# EAGLE design FordACPAUX (EAGLE 8.2.2)
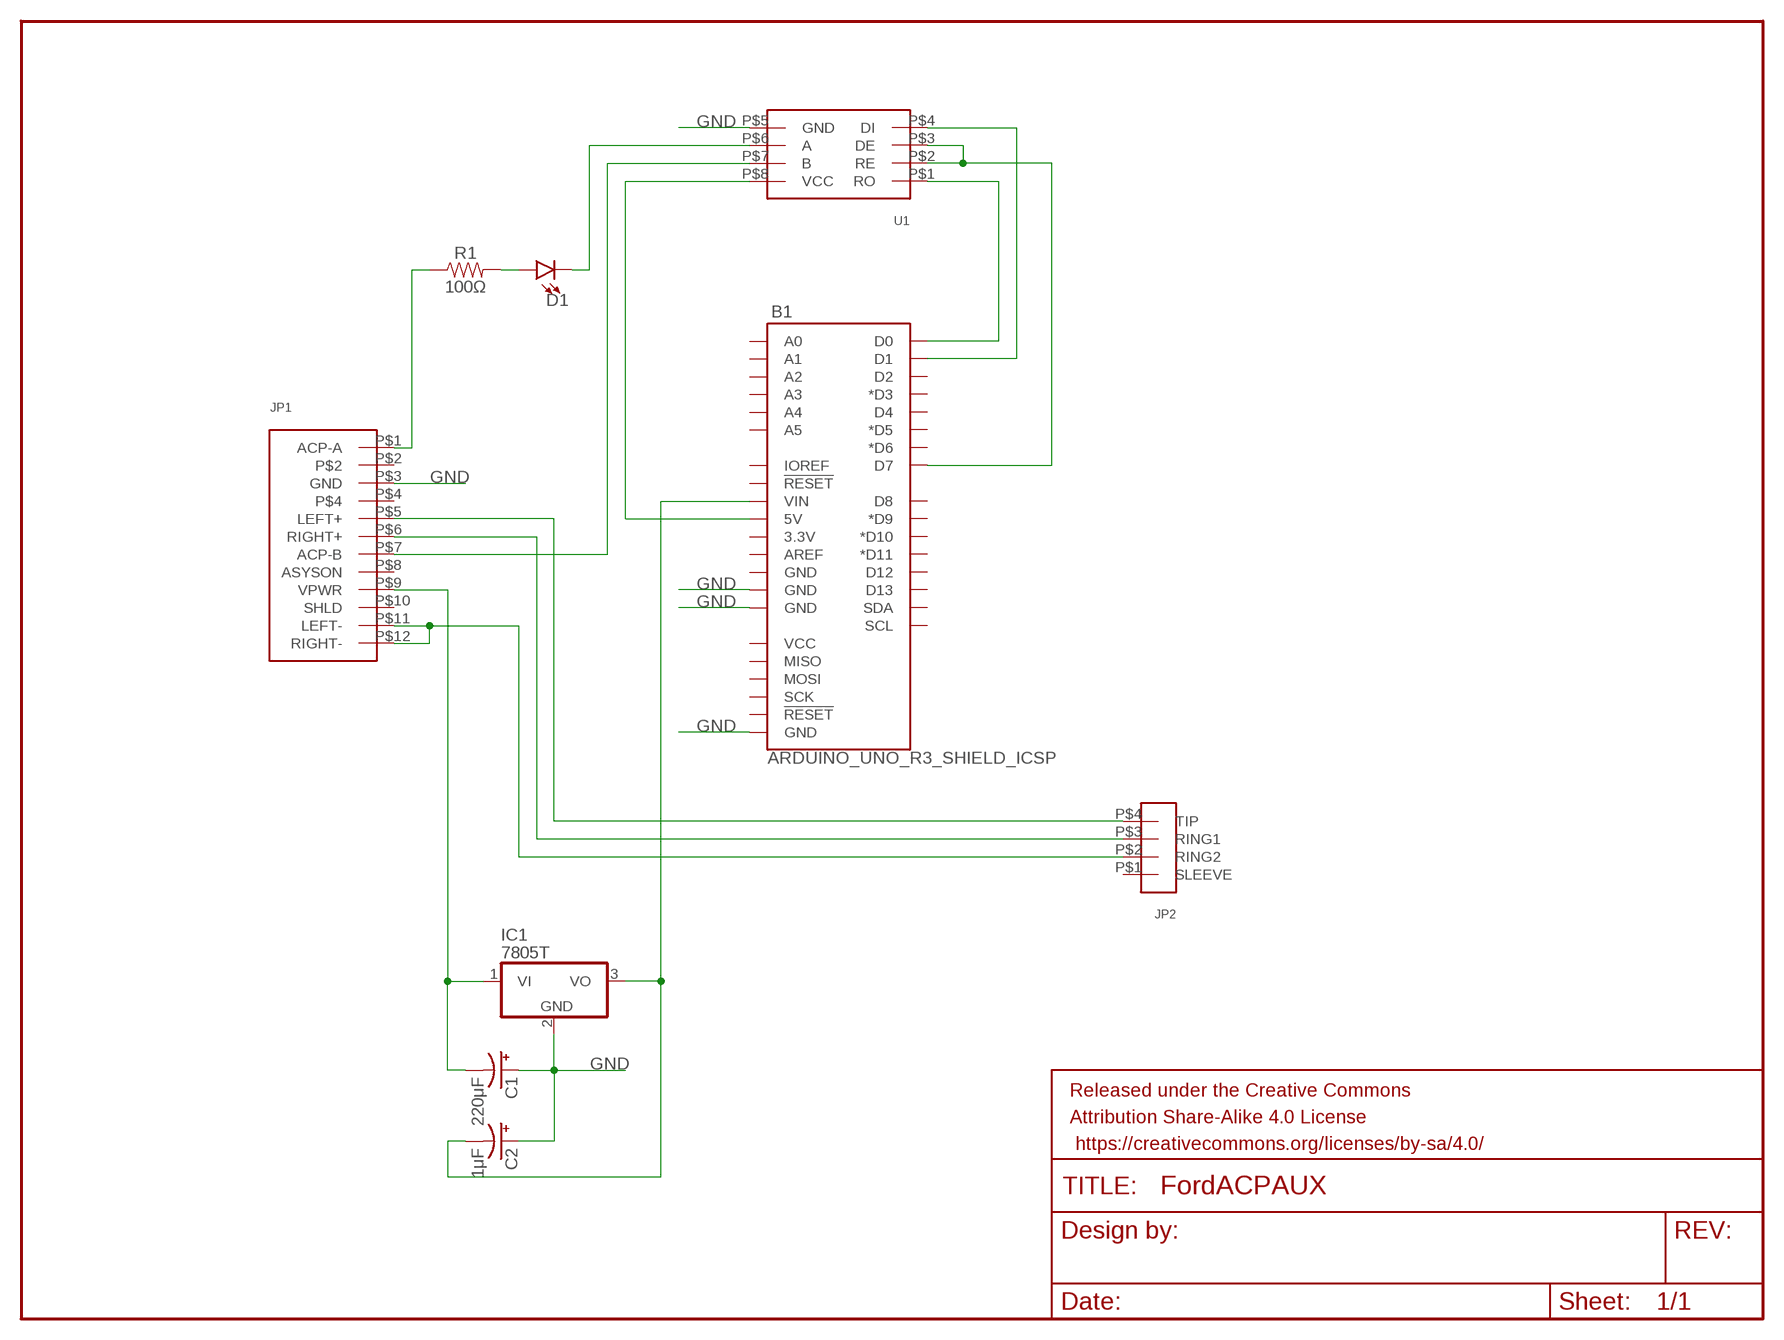
[diagram p0: schematic, sheet 1]

## Parts
B1  ARDUINO_UNO_R3_SHIELD_ICSP  [UNO_R3_SHIELD_ICSP]
C1  220μF  CPOL-USE2.5-7  [E2,5-7]
C2  1μF  CPOL-USE2-4  [E2-4]
D1  LED3MM  [LED_3MM]
FRAME1  FRAME-LETTER  [CREATIVE_COMMONS]
IC1  7805T  [TO220H]
JP1  AMP-174051-2_040_MULTILOCK  [AMP_174051-2_040_MULTILOCK]
JP2  TRRS_JACKBREAKOUT  [HEADER-4-PIN-TRRS-JACK-BREAKOUT]
R1  100Ω  RESISTORAXIAL-0.3  [AXIAL-0.3]
U1  MAX485_TTL_TO_RS_485_MODULE  [MAX485_TTL_TO_RS_485_MODULE]

## Nets
GND: B1.GND@0(GND) B1.GND@1(GND) B1.GND_ICSP(GND) C1.+ C2.+ IC1.2(GND) JP1.P$3(GND) U1.P$5(GND)
N$1: JP1.P$1(ACP-A) R1.P$1
N$2: JP1.P$7(ACP-B) U1.P$7(B)
N$3: D1.A R1.P$2
N$4: D1.K(C) U1.P$6(A)
N$5: C1.- IC1.1(VI) JP1.P$9(VPWR)
N$6: B1.5V U1.P$8(VCC)
N$7: B1.D7 U1.P$2(RE) U1.P$3(DE)
N$9: B1.RX(D0) U1.P$1(RO)
N$10: B1.TX(D1) U1.P$4(DI)
N$11: JP1.P$5(LEFT+) JP2.P$4(TIP)
N$12: JP1.P$6(RIGHT+) JP2.P$3(RING1)
N$13: JP1.P$11(LEFT-) JP1.P$12(RIGHT-) JP2.P$2(RING2)
N$15: B1.VIN C2.- IC1.3(VO)
Unconnected: B1.3.3V B1.5V_ICSP(VCC) B1.A0 B1.A1 B1.A2 B1.A3 B1.A4 B1.A5 B1.AREF B1.D2 B1.D3(*D3) B1.D4 B1.D5(*D5) B1.D6(*D6) B1.D8 B1.D9(*D9) B1.D10(*D10) B1.D11(*D11) B1.D12 B1.D13 B1.GND@2(GND) B1.IOREF B1.MISO B1.MOSI B1.RES(!RESET!) B1.RST_ICSP(!RESET!) B1.SCK B1.SCL B1.SDA JP1.P$2 JP1.P$4 JP1.P$8(ASYSON) JP1.P$10(SHLD) JP2.P$1(SLEEVE)

## Library data of the parts
B1 = SparkFun-Boards:ARDUINO_UNO_R3_SHIELD_ICSP: Arduino R3 Shield Footprint with ICSP Header Includes pins for 6-pin (2x3) ICSP Header. Compatible with Leonardo boards that require SPI pin connections via this header. SparkFun Products: CryptoShield <https://www.sparkfun.com/products/13183> microSD Shield <https://www.sparkfun.com/products/12761> R3 Stackable Headers Kit <https://www.sparkfun.com/products/1417>
C1 C2 = adafruit:CPOL-US: POLARIZED CAPACITOR, American symbol
D1 = SparkFun-LED:LED: LED (Generic) Standard schematic elements and footprints for 5mm, 3mm, 1206, and 0603 sized LEDs. Generic LEDs with no color specified.; PROD_ID: DIO-08794
FRAME1 = SparkFun-Aesthetics:FRAME-LETTER: Schematic Frame - Letter Standard 8.5x11 US Letter frame
IC1 = linear:78*: Positive VOLTAGE REGULATOR Source: http://cache.national.com/ds/LM/LM78L05.pdf http://www.fairchildsemi.com/ds/LM/LM7805.pdf
JP1 = Liu-Ford-ACP-AUX:AMP-174051-2_040_MULTILOCK
JP2 = Liu-Ford-ACP-AUX:TRRS_JACK
R1 = SparkFun-Resistors:RESISTOR: Generic Resistor Package
U1 = Liu-Ford-ACP-AUX:MAX485_TTL_TO_RS_485_MODULE

## Board
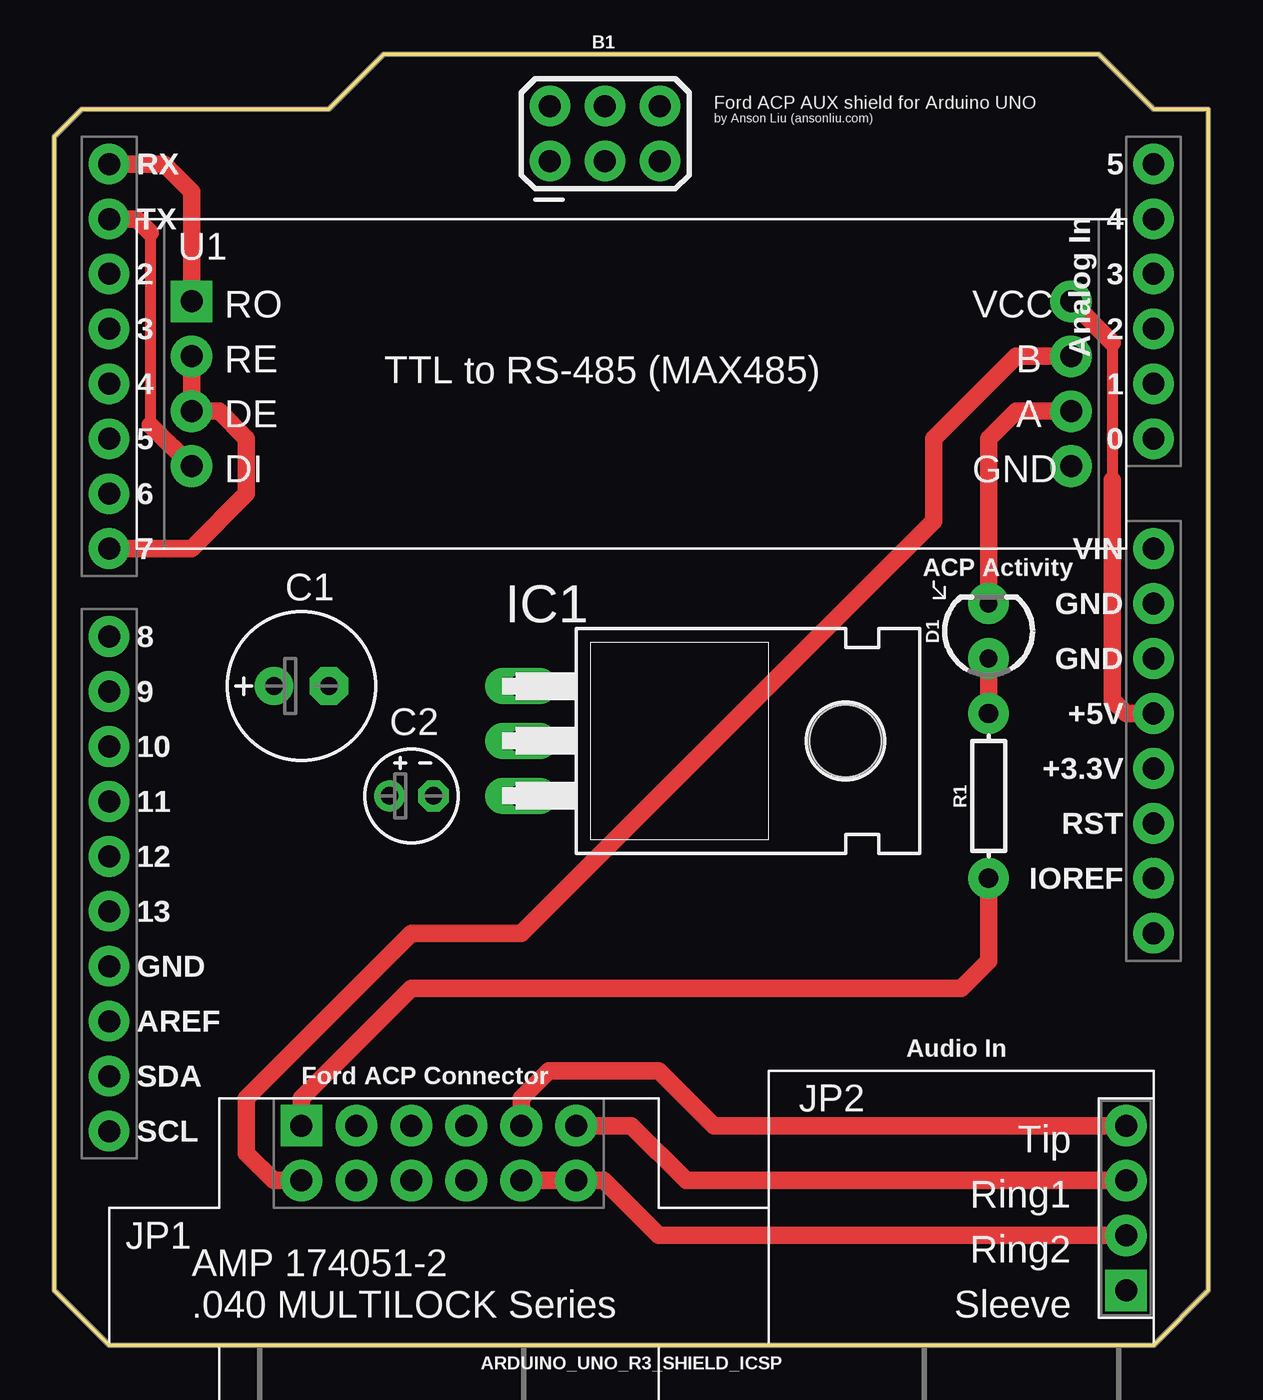
[diagram p1: board, top side]
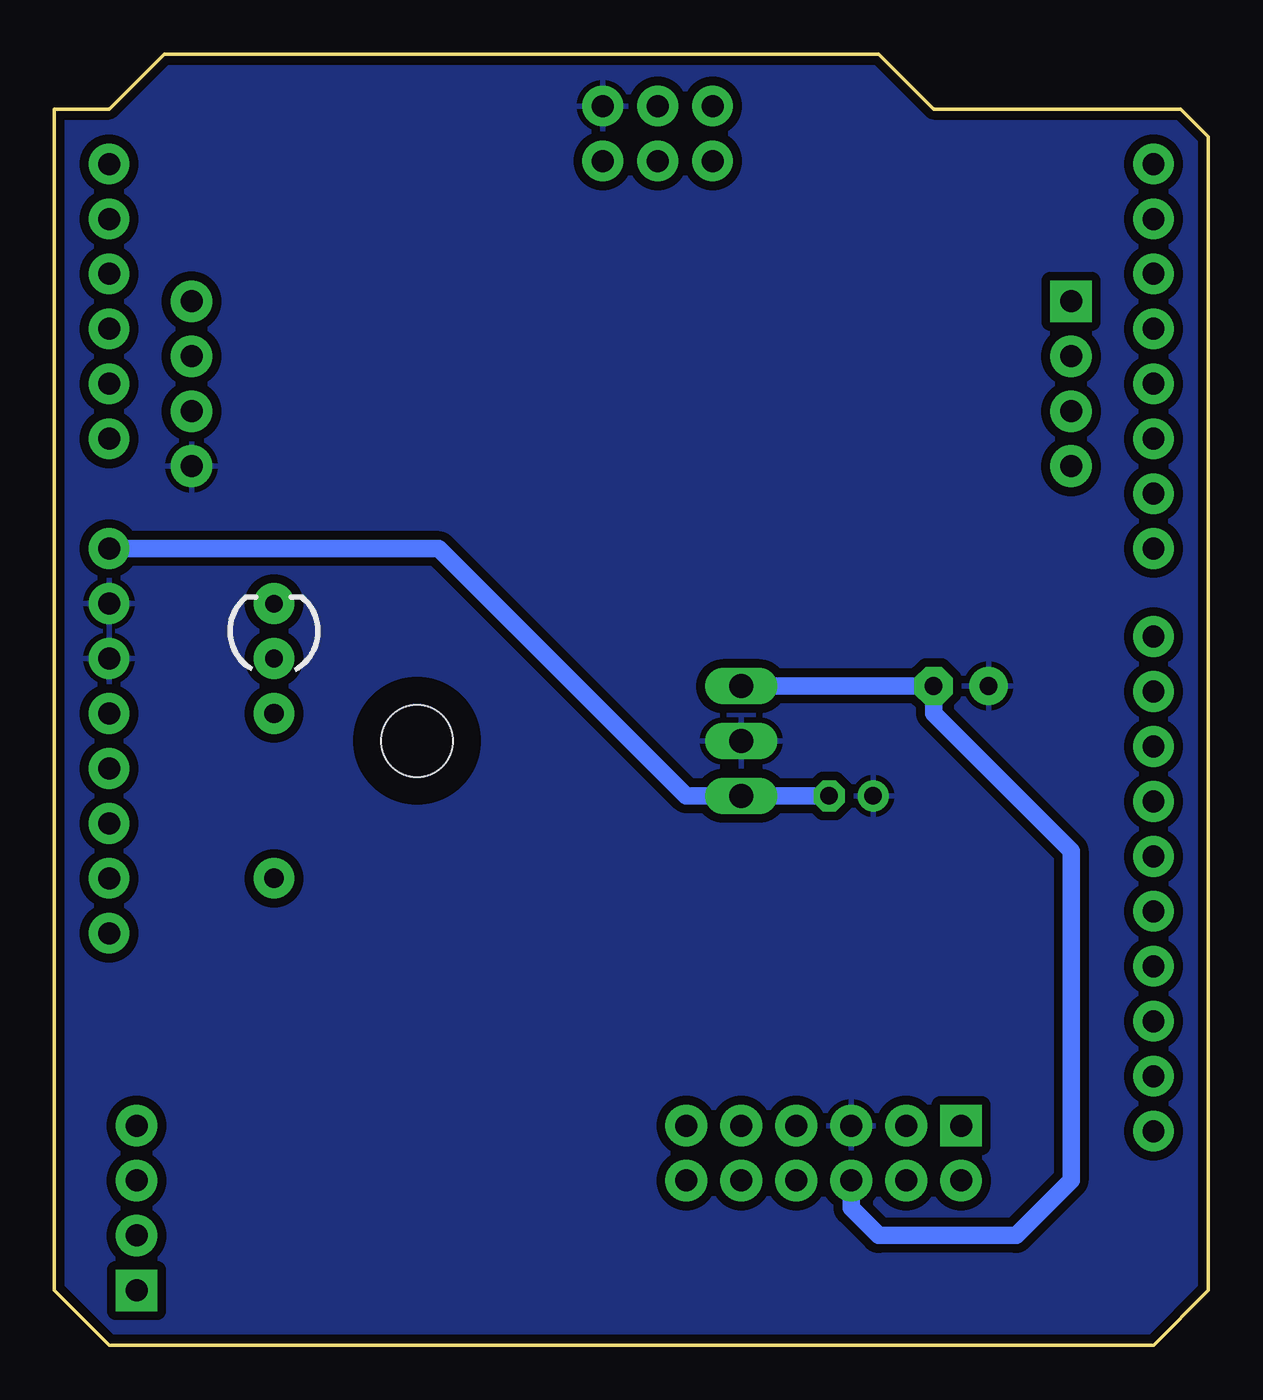
[diagram p2: board, bottom side, seen from below]

Size 53.34 x 59.69 mm. Coordinates in mm from the lower left corner, seen from the top.
Outline: 0,2.54 2.54,0 50.8,0 53.34,2.54 53.34,57.15 50.8,57.15 48.26,59.69 15.24,59.69 12.7,57.15 1.27,57.15 0,55.88 0,2.54
Copper layers (1*16): Top 0.035559375mm / dielectric 1.6mm / Bottom 0.035559375mm
Design rules "oshpark-2layer": minimum track width 6mil, minimum drill 10mil, track to track 6mil, track to pad 6mil, pad to pad 6mil, via to via 6mil, smd to smd 6mil, copper to edge 15mil, drill to drill 6mil, minimum pad ring 5mil, minimum via ring 5mil, stop-mask expansion 2.5mil, vias tented up to drill 0mil, thermal gap 10mil

### Footprints (pad centres in the part's own frame; a part is rotated, then mirrored left to right if it is on the bottom)
UNO_R3_SHIELD_ICSP = drill 1.016 pad 1.88: 3.3V 24.13,-3.81; 5V 24.13,-1.27; 5V_ICSP -3.76,26.81; A0 24.13,11.43; A1 24.13,13.97; A2 24.13,16.51; A3 24.13,19.05; A4 24.13,21.59; A5 24.13,24.13; AREF -24.13,-15.494; D2 -24.13,19.05; D3 -24.13,16.51; D4 -24.13,13.97; D5 -24.13,11.43; D6 -24.13,8.89; D7 -24.13,6.35; D8 -24.13,2.286; D9 -24.13,-0.254; D10 -24.13,-2.794; D11 -24.13,-5.334; D12 -24.13,-7.874; D13 -24.13,-10.414; GND@0 24.13,1.27; GND@1 24.13,3.81; GND@2 -24.13,-12.954; GND_ICSP 1.32,26.81; IOREF 24.13,-8.89; MISO -3.76,24.27; MOSI -1.22,26.81; NC 24.13,-11.43; RES 24.13,-6.35; RST_ICSP 1.32,24.27; RX -24.13,24.13; SCK -1.22,24.27; SCL -24.13,-20.574; SDA -24.13,-18.034; TX -24.13,21.59; VIN 24.13,6.35
E2,5-7 = drill 0.813 pad 1.778: + -1.27,0 | drill 0.813 pad 1.778 octagon: - 1.27,0
E2-4 = drill 0.813 pad 1.422: + -1.016,0 | drill 0.813 pad 1.422 octagon: - 1.016,0
LED_3MM = drill 0.813 pad 1.88: A -1.27,0; K 1.27,0
TO220H = drill 1.118 long: 1 -2.54,-10.16; 2 0,-10.16; 3 2.54,-10.16 | hole 3.302: 0,4.826
AMP_174051-2_040_MULTILOCK = drill 1.016 pad 1.93 square: P$1 1.27,6.35 | drill 1.016 pad 1.93: P$2 1.27,3.81; P$3 1.27,1.27; P$4 1.27,-1.27; P$5 1.27,-3.81; P$6 1.27,-6.35; P$7 -1.27,6.35; P$8 -1.27,3.81; P$9 -1.27,1.27; P$10 -1.27,-1.27; P$11 -1.27,-3.81; P$12 -1.27,-6.35
HEADER-4-PIN-TRRS-JACK-BREAKOUT = drill 1.016 pad 1.93 square: P$1 -3.81,0 | drill 1.016 pad 1.93: P$2 -1.27,0; P$3 1.27,0; P$4 3.81,0
AXIAL-0.3 = drill 0.9 pad 1.88: P$1 -3.81,0; P$2 3.81,0
MAX485_TTL_TO_RS_485_MODULE = drill 1.016 pad 1.93 square: P$1 -20.32,3.81 | drill 1.016 pad 1.93: P$2 -20.32,1.27; P$3 -20.32,-1.27; P$4 -20.32,-3.81; P$5 20.32,-3.81; P$6 20.32,-1.27; P$7 20.32,1.27; P$8 20.32,3.81

### Placement (x,y rotation side)
B1  26.67,30.48 0 top
C1  11.43,30.48 0 top
C2  16.51,25.4 0 top
D1  43.18,33.02 90 top
FRAME1  -1.27,-26.67 0 top  (outside the outline)
IC1  31.75,27.94 270 top
JP1  17.78,8.89 90 top
JP2  49.53,6.35 90 top
R1  43.18,25.4 90 top
U1  26.67,44.45 0 top

### Tracks (layer width: path | path; a pad name or v marks a point on that pad's centre or on a via)
GND
  pour Bottom (isolate 0.406): 0,2.54 2.54,0 50.8,0 53.34,2.54 53.34,57.15 50.8,57.15 48.26,59.69 15.24,59.69 12.7,57.15 1.27,57.15 0,55.88
N$1
  Top 0.813: JP1.P$1 11.43,11.43 16.51,16.51 41.91,16.51 43.18,17.78 R1.P$1
N$2
  Top 0.813: JP1.P$7 10.16,7.62 8.89,8.89 8.89,11.43 16.51,19.05 21.59,19.05 40.64,38.1 40.64,41.91 44.45,45.72 U1.P$7
N$3
  Top 0.813: R1.P$2 D1.A
N$4
  Top 0.813: D1.K 43.18,41.91 44.45,43.18 U1.P$6
N$5
  Bottom 0.813: JP1.P$9 16.51,6.35 15.24,5.08 8.89,5.08 6.35,7.62 6.35,22.86 12.7,29.21 C1.- IC1.1
N$6
  Top 0.508: 48.9,46.35 48.9,40.01
  Top 0.813: U1.P$8 48.9,46.35 | 48.9,40.01 48.9,29.84 49.53,29.21 B1.5V
N$7
  Top 0.813: B1.D7 6.35,36.83 8.89,39.37 8.89,41.91 7.62,43.18 U1.P$3 U1.P$2
N$9
  Top 0.813: B1.RX 5.08,54.61 6.35,53.34 U1.P$1
N$10
  Top 0.508: 4.45,51.44 4.45,42.55
  Top 0.813: B1.TX 3.81,52.07 4.45,51.44 | 4.45,42.55 U1.P$4
N$11
  Top 0.813: JP1.P$5 21.59,11.43 22.86,12.7 27.94,12.7 30.48,10.16 JP2.P$4
N$12
  Top 0.813: JP1.P$6 26.67,10.16 29.21,7.62 JP2.P$3
N$13
  Top 0.813: JP1.P$11 JP1.P$12 25.4,7.62 27.94,5.08 JP2.P$2
N$15
  Bottom 0.813: C2.- IC1.3 24.13,25.4 35.56,36.83 B1.VIN

### Text on the board
tPlace: Ford ACP AUX shield for Arduino UNO | by Anson Liu (ansonliu.com) | ACP Activity | Audio In | Ford ACP Connector